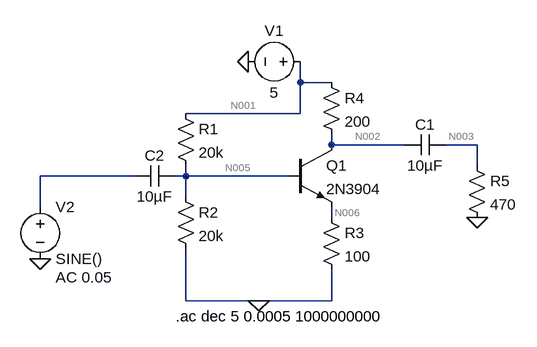
[diagram p0: schematic Draft6.asc]
Draft6.asc, the LTspice schematic file:
Version 4
SHEET 1 1912 680
WIRE 240 160 240 128
WIRE 288 160 240 160
WIRE 240 208 240 160
WIRE 240 208 64 208
WIRE 288 256 288 240
WIRE 400 256 288 256
WIRE 512 256 464 256
WIRE 512 288 512 256
WIRE -16 304 -160 304
WIRE 64 304 64 288
WIRE 64 304 48 304
WIRE 224 304 64 304
WIRE 64 336 64 304
WIRE -160 352 -160 304
WIRE 288 368 288 352
WIRE 64 496 64 416
WIRE 176 496 64 496
WIRE 288 496 288 448
WIRE 288 496 176 496
FLAG 160 128 0
FLAG 176 496 0
FLAG -160 432 0
FLAG 512 368 0
SYMBOL voltage 256 128 R90
WINDOW 0 -32 56 VBottom 2
WINDOW 3 32 56 VTop 2
WINDOW 123 0 0 Left 0
WINDOW 39 0 0 Left 0
SYMATTR InstName V1
SYMATTR Value 5
SYMBOL res 48 192 R0
SYMATTR InstName R1
SYMATTR Value 20k
SYMBOL res 48 320 R0
SYMATTR InstName R2
SYMATTR Value 20k
SYMBOL res 272 352 R0
SYMATTR InstName R3
SYMATTR Value 100
SYMBOL npn 224 256 R0
SYMATTR InstName Q1
SYMATTR Value 2N3904
SYMBOL res 272 144 R0
SYMATTR InstName R4
SYMATTR Value 200
SYMBOL voltage -160 336 R0
WINDOW 123 24 124 Left 2
WINDOW 39 0 0 Left 0
SYMATTR InstName V2
SYMATTR Value SINE()
SYMATTR Value2 AC 0.05
SYMBOL cap -16 320 R270
WINDOW 0 32 32 VTop 2
WINDOW 3 0 32 VBottom 2
SYMATTR InstName C2
SYMATTR Value 10µF
SYMBOL cap 400 272 R270
WINDOW 0 32 32 VTop 2
WINDOW 3 0 32 VBottom 2
SYMATTR InstName C1
SYMATTR Value 10µF
SYMBOL res 496 272 R0
SYMATTR InstName R5
SYMATTR Value 470
TEXT 48 520 Left 2 !.ac dec 5 0.0005 1000000000

The netlist it stands for:
* Draft6.asc
V1 N001 0 5
R1 N001 N005 20k
R2 N005 0 20k
R3 N006 0 100
Q1 N002 N005 N006 0 2N3904
R4 N001 N002 200
V2 N004 0 SINE() AC 0.05
C2 N004 N005 10µF
C1 N002 N003 10µF
R5 N003 0 470
.model NPN NPN
.model PNP PNP
.lib standard.bjt
.ac dec 5 0.0005 1000000000
.backanno
.end

* Results of the author's LTspice run, read from the files saved beside the schematic
* Operating Point, zero values left out:
*   V(n001) = 5 V
*   V(n005) = 2.048 V
*   V(n006) = 1.323 V
*   V(n002) = 2.363 V
*   Ic(Q1) = 13.18 mA
*   Ib(Q1) = 45.24 µA
*   Ie(Q1) = -13.23 mA
*   I(R4) = 13.18 mA
*   I(R3) = 13.23 mA
*   I(R2) = 102.4 µA
*   I(R1) = 147.6 µA
*   I(V1) = -13.33 mA
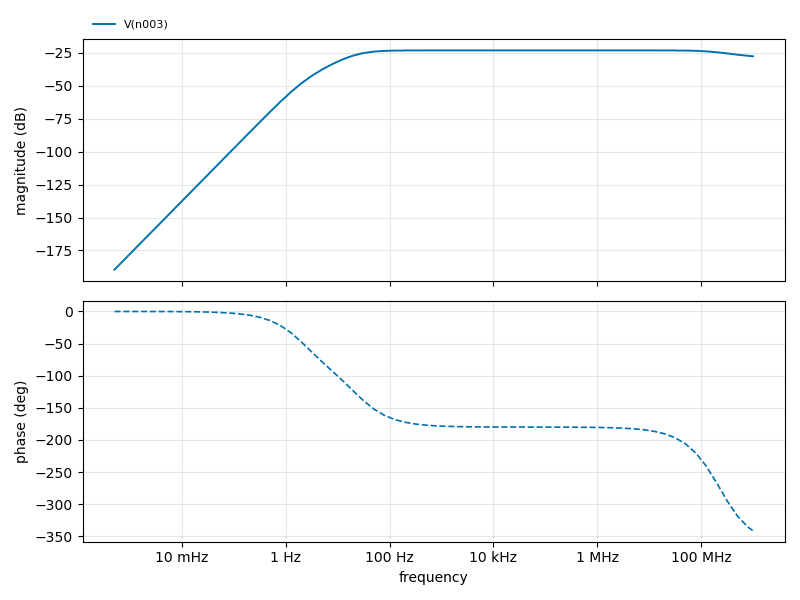
[diagram p1: AC Analysis of Draft6.asc, plotted from the saved traces]
* AC Analysis, 1 run:
*   V(n003): -189.56 dB at 500 µHz, -27.74 dB at 1 GHz, peak -23.30 dB at 79.24 kHz, 3 dB below the peak at 24.6 Hz and 445.3 MHz